# Altium schematic sheet IO_Pheripheral.SchDoc
size A; SheetNumber: 3; SheetTotal: 3
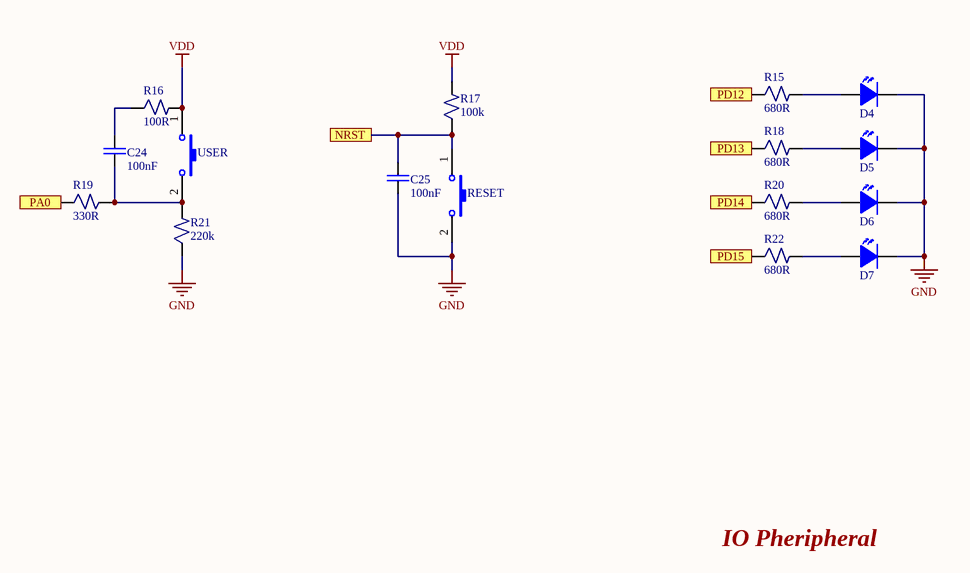
[diagram p0: IO_Pheripheral.SchDoc]

## Parts
C24  value 100nF  [C0805]  (hidden comment: Cap Non-Pol)
C25  value 100nF  [C0805]  (hidden comment: Cap Non-Pol)
D4  LED  [LED0805]  (value not drawn)
D5  LED  [LED0805]  (value not drawn)
D6  LED  [LED0805]  (value not drawn)
D7  LED  [LED0805]  (value not drawn)
R15  value 680R  [R0805]  (hidden comment: Resistor)
R16  value 100R  [R0805]  (hidden comment: Resistor)
R17  value 100k  [R0805]  (hidden comment: Resistor)
R18  value 680R  [R0805]  (hidden comment: Resistor)
R19  value 330R  [R0805]  (hidden comment: Resistor)
R20  value 680R  [R0805]  (hidden comment: Resistor)
R21  value 220k  [R0805]  (hidden comment: Resistor)
R22  value 680R  [R0805]  (hidden comment: Resistor)
RESET  SW-2P-S  [SW2-SMD]  (value not drawn)
USER  SW-2P-S  [SW2-SMD]  (value not drawn)

## Ports
NRST, PA0, PD12, PD13, PD14, PD15

## Nets
GND: C25.1 D4.2 D5.2 D6.2 D7.2 R21.1 RESET.2
VDD: R16.2 R17.2 USER.1
NRST: C25.2 R17.1 RESET.1 ; port NRST
PA0: R19.1 ; port PA0
PD12: R15.1 ; port PD12
PD13: R18.1 ; port PD13
PD14: R20.1 ; port PD14
PD15: R22.1 ; port PD15
NetC24_1: C24.1 R19.2 R21.2 USER.2
NetC24_2: C24.2 R16.1
NetD4_1: D4.1 R15.2
NetD5_1: D5.1 R18.2
NetD6_1: D6.1 R20.2
NetD7_1: D7.1 R22.2

## Notes on the sheet
- IO Pheripheral

## Library data of the parts
C24 C25 = Cap Non-Pol: Non-Polarized Capacitor
R15 R18 R20 R22 = Resistor_9
R16 = Resistor_7
R17 = Resistor_6
R19 = Resistor_5
R21 = Resistor_8
RESET USER = SW-2P: Switch Small 2 Pin; Published: 24-Mar-1999; LatestRevisionDate: 17-Jul-2002; LatestRevisionNote: Re-released for DXP Platform.; PackageReference: SPST-2; Publisher: Altium Limited